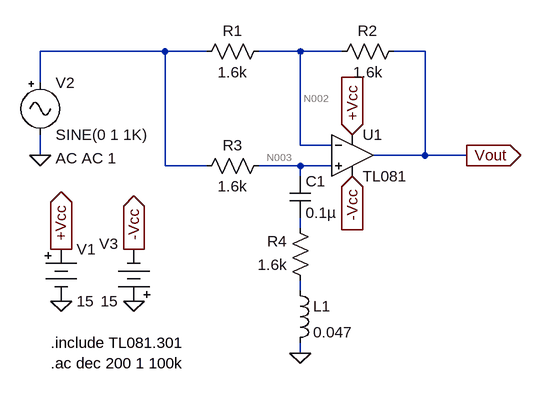
[diagram p0: schematic RLC Notch.asc]
RLC Notch.asc, the LTspice schematic file:
Version 4
SHEET 1 880 680
WIRE 16 144 -176 144
WIRE 80 144 16 144
WIRE 224 144 160 144
WIRE 288 144 224 144
WIRE 416 144 368 144
WIRE -176 192 -176 144
WIRE 224 288 224 144
WIRE 272 288 224 288
WIRE -176 304 -176 272
WIRE 416 304 416 144
WIRE 416 304 336 304
WIRE 480 304 416 304
WIRE 16 320 16 144
WIRE 80 320 16 320
WIRE 224 320 160 320
WIRE 272 320 224 320
WIRE 224 336 224 320
WIRE 224 416 224 400
WIRE 224 512 224 496
WIRE 224 608 224 592
FLAG 224 608 0
FLAG 480 304 Vout
IOPIN 480 304 Out
FLAG 304 272 +Vcc
IOPIN 304 272 In
FLAG 304 336 -Vcc
IOPIN 304 336 In
FLAG -144 448 +Vcc
IOPIN -144 448 Out
FLAG -32 448 -Vcc
IOPIN -32 448 Out
FLAG -32 528 0
FLAG -144 528 0
FLAG -176 304 0
SYMBOL res 176 128 R90
WINDOW 0 0 56 VBottom 2
WINDOW 3 32 56 VTop 2
SYMATTR InstName R1
SYMATTR Value 1.6k
SYMBOL res 384 128 R90
WINDOW 0 0 56 VBottom 2
WINDOW 3 32 56 VTop 2
SYMATTR InstName R2
SYMATTR Value 1.6k
SYMBOL res 176 304 R90
WINDOW 0 0 56 VBottom 2
WINDOW 3 32 56 VTop 2
SYMATTR InstName R3
SYMATTR Value 1.6k
SYMBOL res 240 512 R180
WINDOW 0 36 76 Left 2
WINDOW 3 36 40 Left 2
SYMATTR InstName R4
SYMATTR Value 1.6k
SYMBOL cap 208 336 R0
SYMATTR InstName C1
SYMATTR Value 0.1µ
SYMBOL ind 208 496 R0
SYMATTR InstName L1
SYMATTR Value 0.047
SYMBOL OpAmps\\opamp2 304 240 R0
SYMATTR InstName U1
SYMATTR Value TL081
SYMBOL Misc\\battery -144 432 R0
WINDOW 123 0 0 Left 0
WINDOW 39 0 0 Left 0
SYMATTR InstName V1
SYMATTR Value 15
SYMBOL Misc\\battery -32 544 R180
WINDOW 0 24 104 Left 2
WINDOW 3 24 16 Left 2
WINDOW 123 0 0 Left 0
WINDOW 39 0 0 Left 0
SYMATTR InstName V3
SYMATTR Value 15
SYMBOL Misc\\signal -176 176 R0
WINDOW 123 24 132 Left 2
WINDOW 39 0 0 Left 0
SYMATTR InstName V2
SYMATTR Value2 AC AC 1
TEXT -160 592 Left 2 !.include TL081.301
TEXT -160 624 Left 2 !.ac dec 200 1 100k

The netlist it stands for:
* RLC Notch.asc
R1 N002 N001 1.6k
R2 Vout N002 1.6k
R3 N003 N001 1.6k
R4 N005 N004 1.6k
C1 N003 N004 0.1µ
L1 N005 0 0.047
XU1 N003 N002 +Vcc -Vcc Vout TL081  ; pins In+ In- V+ V- OUT
V1 +Vcc 0 15
V3 0 -Vcc 15
V2 N001 0 SINE(0 1 1K) AC AC 1
.include TL081.301
.ac dec 200 1 100k
.backanno
.end

* Results of the author's LTspice run, read from the files saved beside the schematic
* Operating Point, zero values left out:
*   V(n002) = 10.9 µV
*   V(vout) = 21.87 µV
*   V(n003) = -72.09 nV
*   V(-vcc) = -15 V
*   V(+vcc) = 15 V
*   I(R1) = 6.812 nA
*   I(R2) = 6.857 nA
*   I(R3) = -45.05 pA
*   I(V1) = -14.19 mA
*   I(V3) = -14.19 mA
*   I(V2) = 6.767 nA
*   Ix(u1:1) = 45.05 pA
*   Ix(u1:2) = 45.05 pA
*   Ix(u1:3) = 14.19 mA
*   Ix(u1:4) = -14.19 mA
*   Ix(u1:5) = -6.857 nA
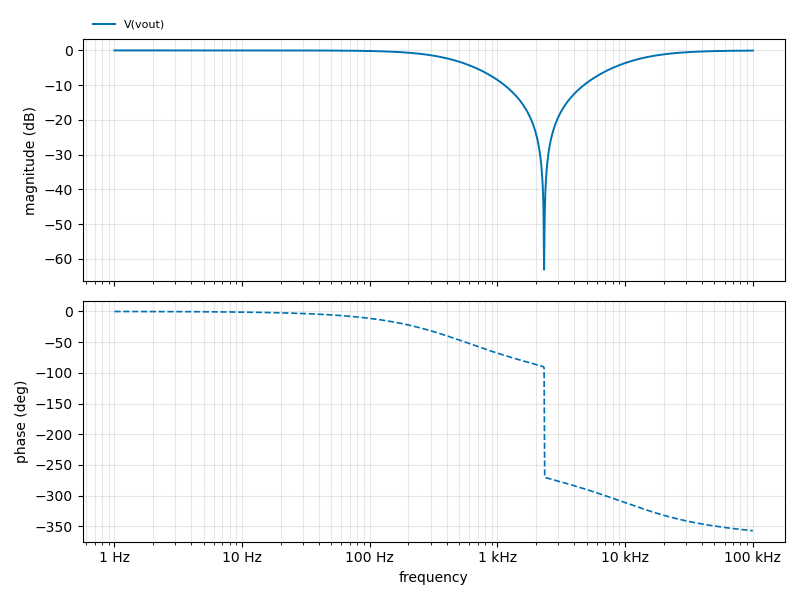
[diagram p1: AC Analysis of RLC Notch.asc, plotted from the saved traces]
* AC Analysis, 1 run:
*   V(vout): -0.00 dB at 1 Hz, -0.06 dB at 100 kHz, peak -0.00 dB at 1 Hz, 3 dB below the peak at 476.4 Hz